# Altium schematic sheet ESP32.SchDoc
size A3; SheetNumber: 1; SheetTotal: 7
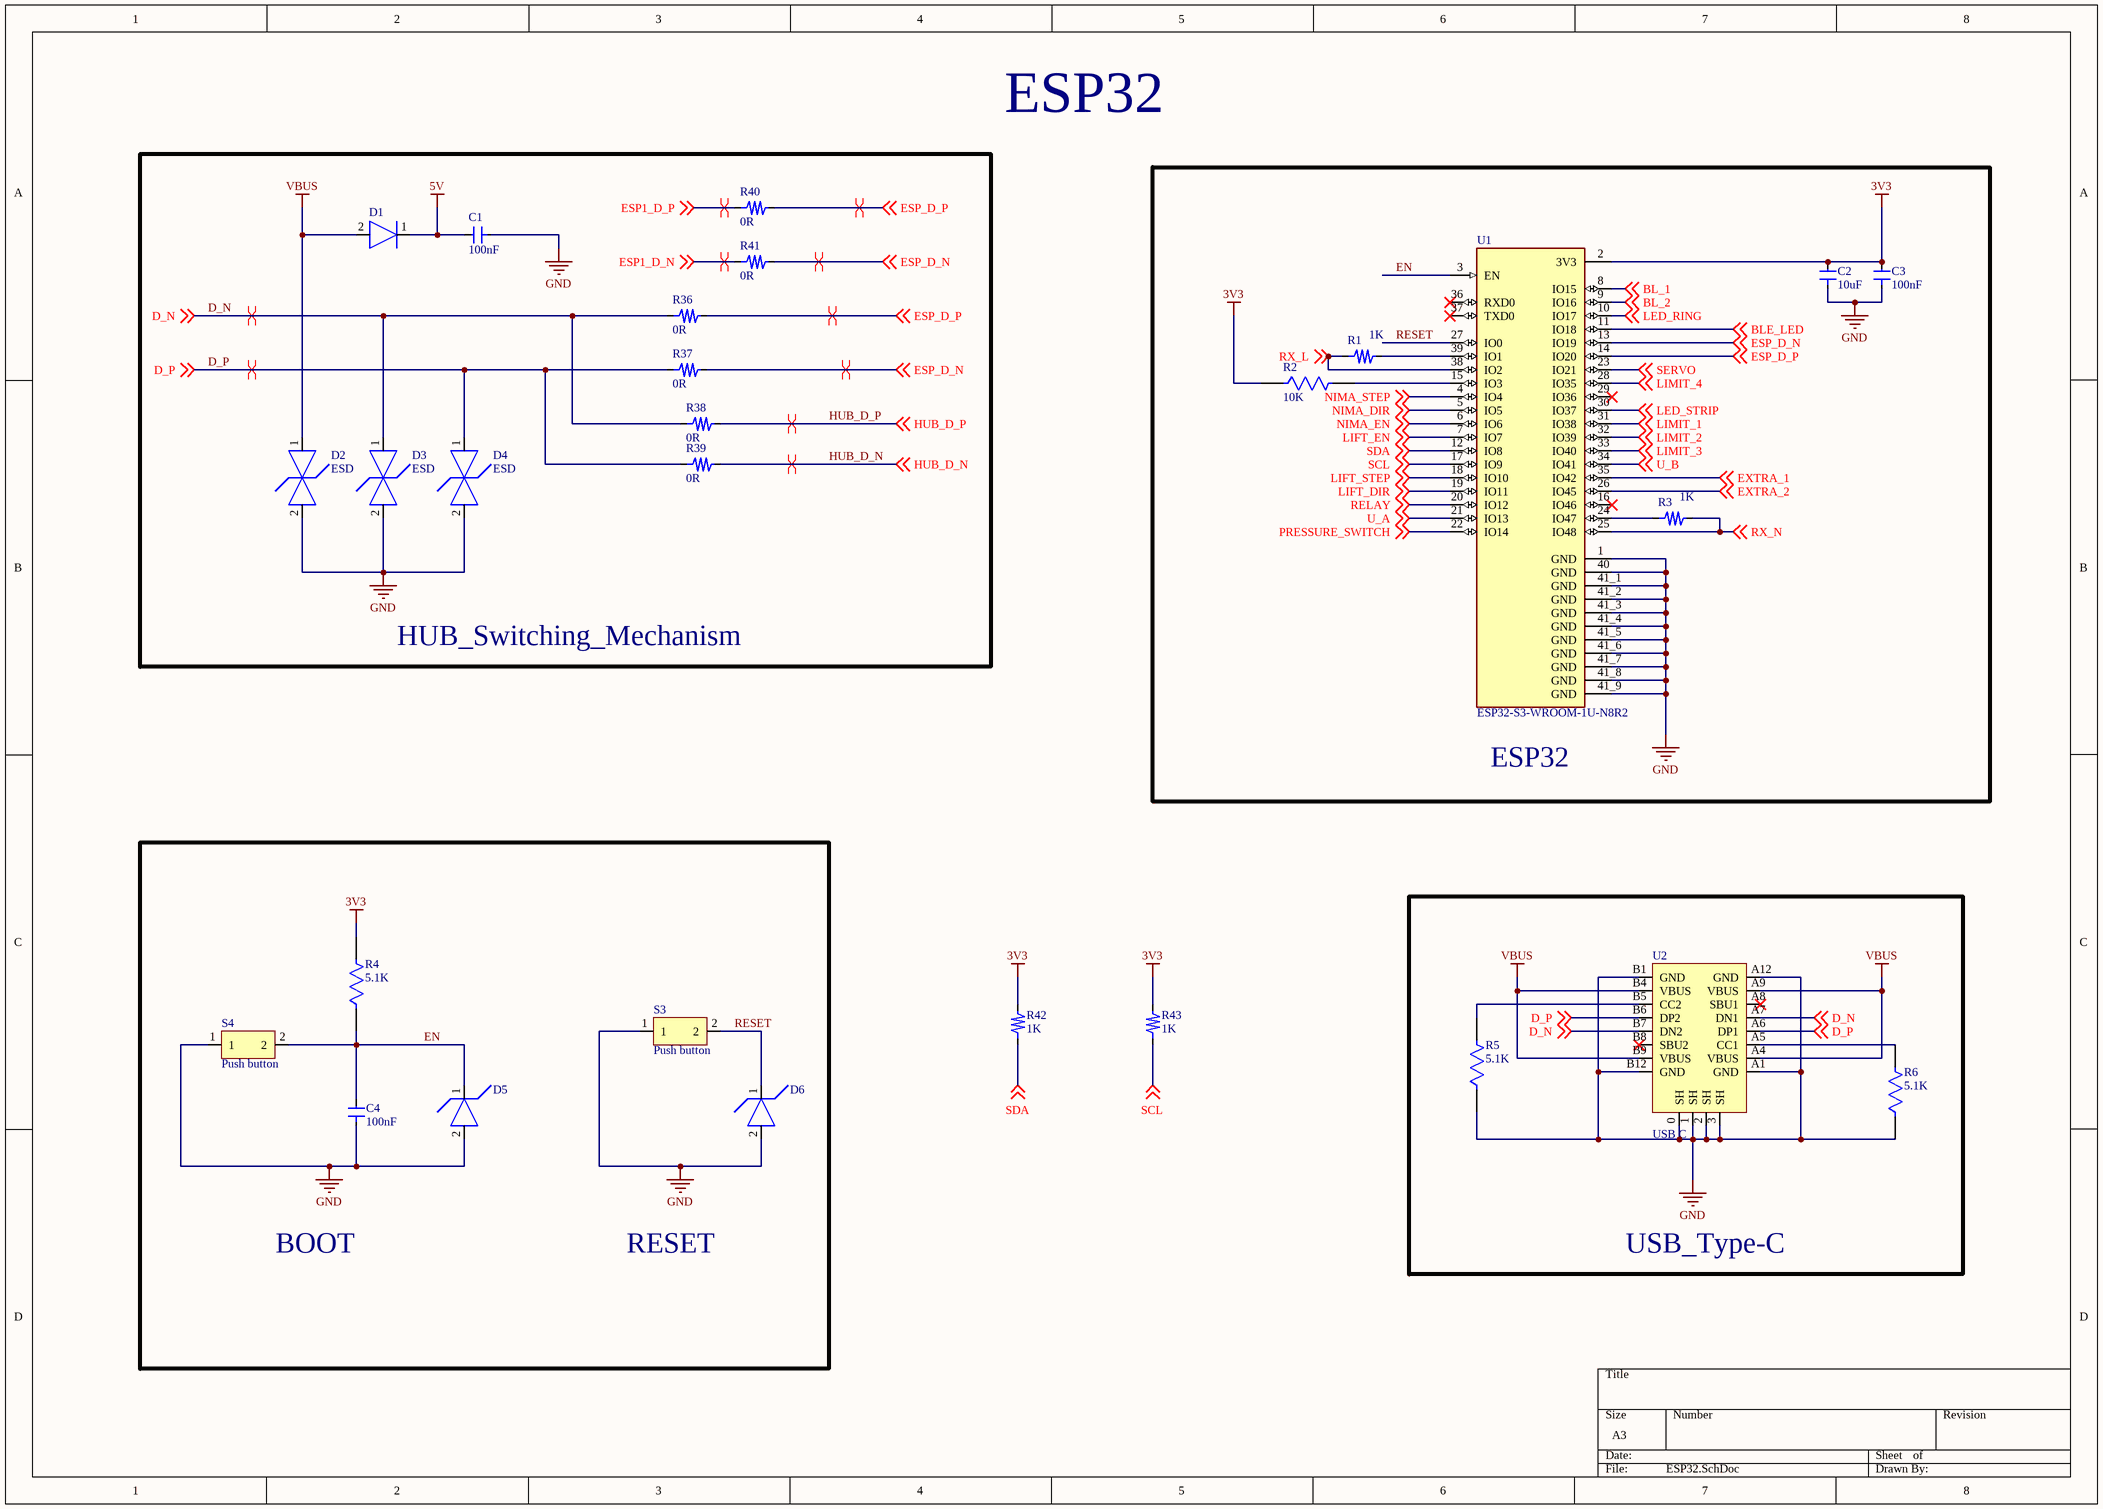
[diagram p0: ESP32.SchDoc]

## Parts
C1  100nF  [CAP 0603]
C2  10uF  [CAP 0603]
C3  100nF  [CAP 0603]
C4  100nF  [CAP 0603]
D1  Diode  [Dioad]  (value not drawn)
D2  ESD  [ESD]
D3  ESD  [ESD]
D4  ESD  [ESD]
D5  SINGAL ESD  [Singal ESD]  (value not drawn)
D6  SINGAL ESD  [Singal ESD]  (value not drawn)
R1  1K  [RES 0603]
R2  10K  [RES 0603]
R3  1K  [RES 0603]
R4  5.1K  [RES 0603]
R5  5.1K  [RES 0603]
R6  5.1K  [RES 0603]
R36  0R  [RES_0201]
R37  0R  [RES_0201]
R38  0R  [RES_0201]
R39  0R  [RES_0201]
R40  0R  [RES_0201]
R41  0R  [RES_0201]
R42  1K  [RES 0603]
R43  1K  [RES 0603]
S3  Push button  [Tactical Switch]
S4  Push button  [Tactical Switch]
U1  ESP32-S3-WROOM-1U-N8R2  [XCVR_ESP32-S3-WROOM-1U-N8R2]
U2  USB C  [TYPE-C]

## Blocks framed on the sheet
HUB_Switching_Mechanism: C1 D1-D4 R36-R41
ESP32: C2 C3 R1-R3 U1
USB_Type-C: R5 R6 U2

## Nets
3V3: C2.2 C3.2 R2.1 R4.2 R42.2 R43.2 U1.2(3V3)
5V: C1.2 D1.1
GND: C1.1 C2.1 C3.1 C4.1 D2.2 D3.2 D4.2 D5.2 D6.2 R5.1 R6.1 S3.1 S4.1 U1.1(GND) U1.40(GND) U1.41_1(GND) U1.41_2(GND) U1.41_3(GND) U1.41_4(GND) U1.41_5(GND) U1.41_6(GND) U1.41_7(GND) U1.41_8(GND) U1.41_9(GND) U2.0(SH) U2.1(SH) U2.2(SH) U2.3(SH) U2.A1(GND) U2.A12(GND) U2.B1(GND) U2.B12(GND)
VBUS: D1.2 D2.1 U2.A4(VBUS) U2.A9(VBUS) U2.B4(VBUS) U2.B9(VBUS)
BL_1: U1.8(IO15) ; off-sheet BL_1
BL_2: U1.9(IO16) ; off-sheet BL_2
BLE_LED: U1.11(IO18) ; off-sheet BLE_LED
D_N: D3.1 R36.1 R38.1 U2.A7(DN1) U2.B7(DN2) ; off-sheet D_N
D_P: D4.1 R37.1 R39.1 U2.A6(DP1) U2.B6(DP2) ; off-sheet D_P
EN: C4.2 D5.1 R4.1 S4.2 U1.3(EN)
ESP1_D_N: R41.1 ; off-sheet ESP1_D_N
ESP1_D_P: R40.1 ; off-sheet ESP1_D_P
ESP_D_N: R37.2 R41.2 U1.13(IO19) ; off-sheet ESP_D_N
ESP_D_P: R36.2 R40.2 U1.14(IO20) ; off-sheet ESP_D_P
EXTRA_1: U1.35(IO42) ; off-sheet EXTRA_1
EXTRA_2: U1.26(IO45) ; off-sheet EXTRA_2
HUB_D_N: R39.2 ; off-sheet HUB_D_N
HUB_D_P: R38.2 ; off-sheet HUB_D_P
LED_RING: U1.10(IO17) ; off-sheet LED_RING
LED_STRIP: U1.30(IO37) ; off-sheet LED_STRIP
LIFT_DIR: U1.19(IO11) ; off-sheet LIFT_DIR
LIFT_EN: U1.7(IO7) ; off-sheet LIFT_EN
LIFT_STEP: U1.18(IO10) ; off-sheet LIFT_STEP
LIMIT_1: U1.31(IO38) ; off-sheet LIMIT_1
LIMIT_2: U1.32(IO39) ; off-sheet LIMIT_2
LIMIT_3: U1.33(IO40) ; off-sheet LIMIT_3
LIMIT_4: U1.28(IO35) ; off-sheet LIMIT_4
NIMA_DIR: U1.5(IO5) ; off-sheet NIMA_DIR
NIMA_EN: U1.6(IO6) ; off-sheet NIMA_EN
NIMA_STEP: U1.4(IO4) ; off-sheet NIMA_STEP
PRESSURE_SWITCH: U1.22(IO14) ; off-sheet PRESSURE_SWITCH
RELAY: U1.20(IO12) ; off-sheet RELAY
RESET: D6.1 S3.2 U1.27(IO0)
RX_L: R1.1 U1.38(IO2) ; off-sheet RX_L
RX_N: R3.2 U1.25(IO48) ; off-sheet RX_N
SCL: R43.1 U1.17(IO9) ; off-sheet SCL
SDA: R42.1 U1.12(IO8) ; off-sheet SDA
SERVO: U1.23(IO21) ; off-sheet SERVO
U_A: U1.21(IO13) ; off-sheet U_A
U_B: U1.34(IO41) ; off-sheet U_B
NetR1_2: R1.2 U1.39(IO1)
NetR2_2: R2.2 U1.15(IO3)
NetR3_1: R3.1 U1.24(IO47)
NetR5_2: R5.2 U2.B5(CC2)
NetR6_2: R6.2 U2.A5(CC1)

Not connected (* = marked no-connect by the designer): U1 16(IO46)* 29(IO36)* 36(RXD0)* 37(TXD0)*; U2 A8(SBU1)* B8(SBU2)*

## Layout directives
differential pair: D_N, D_P, ESP1_D_N, ESP1_D_P, ESP_D_N, ESP_D_P, HUB_D_N, HUB_D_P

## Notes on the sheet
- ESP32
- BOOT
- RESET

## Library data of the parts
C1 C3 C4 = Capasitor: Part Number: CC0603JRX7R9BB104; Manufacture: YAGEO; Footprint size: 0603; ComponentLink1Description: New link; ComponentLink1URL: *; Supplier: LCSC; Supplier Part Number: C91183; Link: https://www.lcsc.com/product-detail/C91183.html
C2 = Capasitor: Part Number: CC0603KRX5R5BB106; Manufacture: YAGEO; Footprint size: 0603; ComponentLink1Description: New link; ComponentLink1URL: *; Supplier: LCSC; Supplier Part Number: C109455; Link: https://www.lcsc.com/product-detail/C109455.html
D1 = Diode: Manufacture: Guangdong Hottech; Part Number: 1N5819WS; Footprint size: SOD-323; Supplier Part Number: C191023; Supplier: LCSC; Link: https://www.lcsc.com/product-detail/C191023.html?s_z=n_1N5819WS
D2-D4 = ESD: Manufacture: UMW; Part Number: LESD5D5.0CT1G(UMW); Footprint size: SOD-523; Supplier: LCSC; Supplier Part Number: C5199850; Link: https://www.lcsc.com/product-detail/C5199850.html?s_z=n_LESD5D5.0CT1G
D5 D6 = SINGAL ESD: Manufacture: onsemi; Part Number: ESD5Z3.3T1G; Footprint size: SOD-523; Supplier: LCSC; Supplier Part Number: C61148; Link: https://www.lcsc.com/product-detail/C61148.html?s_z=n_ESD5Z3.3T1G
R1 R3 = Resistor: Manufacture: RESI; Part Number: AECR0603F1K00K9; Footprint size: 0603; ComponentLink1Description: New link; ComponentLink1URL: *; Supplier: LCSC; Supplier Part Number: C328340; Link: https://www.lcsc.com/product-detail/C328340.html?spm=wm.fly.bg.0.xh&lcsc_vid=RFYMBlMFQAQLUVJeFVJZXwVeRFYIAgBXEVkPUlxRRVUxVlNRQFNWUFJUQFldUjsOAxUeFF5JWBYZEEoKFBINSQcJGk4eFQsCAgIaSgADAwAHC0slQllXU1RIHxUDCw%3D%3D
R2 = R NEW: Manufacture: YAGEO; Part Number: RC0603JR-0710KL; Footprint size: 0603; ComponentLink1Description: New link; ComponentLink1URL: *; Supplier: LCSC; Supplier Part Number: C99198; Link: https://www.lcsc.com/product-detail/C99198.html
R4-R6 = R NEW: Manufacture: YAGEO; Part Number: RC0603JR-075K1L; Footprint size: 0603; ComponentLink1Description: New link; ComponentLink1URL: *; Supplier: LCSC; Supplier Part Number: C14677; Link: https://www.lcsc.com/product-detail/C14677.html
R36-R41 = Resistor: Manufacture: YAGEO; Part Number: RC0201FR-070RL; Footprint size: 0201; ComponentLink1Description: New link; ComponentLink1URL: *; Supplier: LCSC; Supplier Part Number: C106227; Link: https://www.lcsc.com/product-detail/C106227.html?s_z=n_q_C106227
R42 R43 = Resistor: Manufacture: YAGEO; Part Number: RC0603FR-074K7L; Footprint size: 0603; ComponentLink1Description: New link; ComponentLink1URL: *; Supplier: LCSC; Supplier Part Number: C99782; Link: https://www.lcsc.com/product-detail/C99782.html?spm=wm.fly.bg.0.xh___wm.sxq.dhl.mly.12-6-1&lcsc_vid=RFYMBlMFQAQLUVJeFVJZXwVeRFYIAgBXEVkPUlxRRVUxVlNRT1NdV1xeQ1FZVzsOAxUeFF5JWBYZEEoKFBINSQcJGk4eFQsCAgIaSgADAwAHC0slQ1hbUldfWQkaCgg%3D
S3 S4 = Push button: Manufacture: G-Switch; Part Number: GT-TC060A-H025-L1S; Footprint size: SMD,6x3mm; Supplier: LCSC; Supplier Part Number: C7450623; Link: https://www.lcsc.com/product-detail/C7450623.html
U1 = ESP32-S3-WROOM-1U-N8R2: Bluetooth, WiFi 802.11b/g/n, Bluetooth v5.0 Transceiver Module 2.4GHz Antenna Not Included, U.FL Surface Mount; Manufacture: ESPRESSIF; Part Number: ESP32-S3-WROOM-1U-N8R2; Footprint size: SMD,19.2x18mm; Supplier: LCSC; Supplier Part Number: C3013944; Link: https://www.lcsc.com/product-detail/C3013944.html?s_z=n_q_ESP32-S3-WROOM-1U-N8R2&spm=wm.ssy.bg.0.xh&lcsc_vid=RFYMBlMFQAQLUVJeFVJZXwVeRFYIAgBXEVkPUlxRRVUxVlNRQFVaU1JRR1hdUzsOAxUeFF5JWBYZEEoKFBINSQcJGk4eFQsCAgIaSgADAwAHC0slQ1hbUldfWQkaCgg%3D
U2 = USB C: Manufacture: DEALON; Part Number: USB-TYPE-C-018; Footprint size: SMD; Supplier: LCSC; Supplier Part Number: C2927038; Link: https://www.lcsc.com/product-detail/C2927038.html?s_z=n_q_C2927038&globalKeyword=C2927038